# Altium schematic sheet OTGW01_rev1.SchDoc
size A4; SheetNumber: 1; PageSetup: Record=PageOptions|CenterHorizontal=True|CenterVertical=True|PrintScale=1.00|XCorrection=1.00|YCorrection=1.00|PrintKind=0|BorderSize=5000000|LeftOffset=0|BottomOffset=0|Orientation=2|PaperLength=1000|PaperWidth=1000|Scale=100|PaperSource=7|PrintQuality=-3|MediaType=1|DitherType=10|PrintScaleMode=1|PaperKind=A4|PaperIndex=9
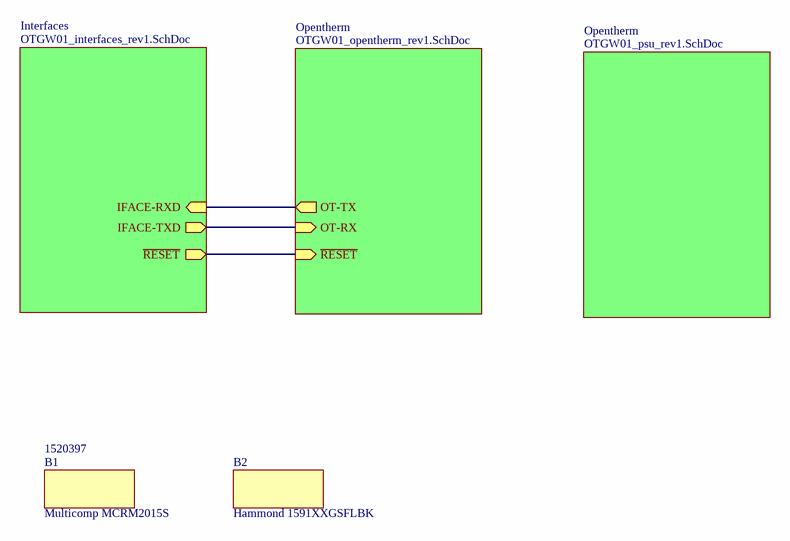
[diagram p0: OTGW01_rev1.SchDoc]

## Parts
B1  Multicomp MCRM2015S  Supplier Part Number 1: 1520397
B2  Hammond 1591XXGSFLBK

## Sub-sheets
Interfaces = OTGW01_interfaces_rev1.SchDoc: IFACE-RXD (in), IFACE-TXD (out), ~{RESET} (out)
Opentherm = OTGW01_opentherm_rev1.SchDoc: OT-TX (out), OT-RX (in), ~{RESET} (in)
Opentherm = OTGW01_psu_rev1.SchDoc: no entries

## Nets
(unnamed): sheet Opentherm/OT-TX, sheet Interfaces/IFACE-RXD
(unnamed): sheet Opentherm/OT-RX, sheet Interfaces/IFACE-TXD
(unnamed): sheet Opentherm/~{RESET}, sheet Interfaces/~{RESET}

## Library data of the parts
B1 = BOMpart: Supplier 1: Farnell
B2 = BOMpart: Description: HAMMOND - 1591XXGSFLBK - ENCLOSURE, MULTIPURPOSE, FLNG LID; Supplier 1: Farnell; Supplier Part Number 1: 1877170